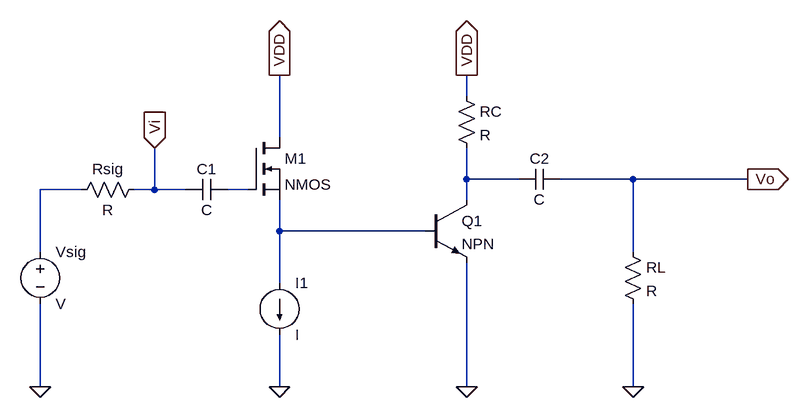
[diagram p0: schematic P1.asc]
P1.asc, the LTspice schematic file:
Version 4
SHEET 1 880 680
WIRE 16 -96 16 -128
WIRE -272 -32 -272 -128
WIRE 16 32 16 -16
WIRE 96 32 16 32
WIRE 272 32 160 32
WIRE 448 32 272 32
WIRE -576 48 -640 48
WIRE -464 48 -464 -16
WIRE -464 48 -496 48
WIRE -416 48 -464 48
WIRE -320 48 -352 48
WIRE 16 64 16 32
WIRE -272 112 -272 64
WIRE -48 112 -272 112
WIRE -640 144 -640 48
WIRE 272 144 272 32
WIRE -272 192 -272 112
WIRE -640 352 -640 224
WIRE -272 352 -272 272
WIRE 16 352 16 160
WIRE 272 352 272 224
FLAG -272 -128 VDD
IOPIN -272 -128 Out
FLAG -272 352 0
FLAG 16 352 0
FLAG 16 -128 VDD
IOPIN 16 -128 Out
FLAG 272 352 0
FLAG -640 352 0
FLAG 448 32 Vo
IOPIN 448 32 Out
FLAG -464 -16 Vi
IOPIN -464 -16 In
SYMBOL current -272 192 R0
SYMATTR InstName I1
SYMBOL nmos -320 -32 R0
SYMATTR InstName M1
SYMBOL cap -352 32 R90
WINDOW 0 0 32 VBottom 2
WINDOW 3 32 32 VTop 2
SYMATTR InstName C1
SYMBOL npn -48 64 R0
SYMATTR InstName Q1
SYMBOL res 0 -112 R0
SYMATTR InstName RC
SYMBOL cap 160 16 R90
WINDOW 0 0 32 VBottom 2
WINDOW 3 32 32 VTop 2
SYMATTR InstName C2
SYMBOL res 256 128 R0
SYMATTR InstName RL
SYMBOL voltage -640 128 R0
SYMATTR InstName Vsig
SYMBOL res -480 32 R90
WINDOW 0 0 56 VBottom 2
WINDOW 3 32 56 VTop 2
SYMATTR InstName Rsig

The netlist it stands for:
* P1.asc
I1 N004 0 I
M1 VDD N003 N004 N004 NMOS
C1 N003 Vi C
Q1 N001 N004 0 0 NPN
RC VDD N001 R
C2 Vo N001 C
RL Vo 0 R
Vsig N002 0 V
Rsig Vi N002 R
.model NPN NPN
.model PNP PNP
.lib standard.bjt
.model NMOS NMOS
.model PMOS PMOS
.lib standard.mos
.backanno
.end